# EAGLE design camera-endpoint (EAGLE 8.3.2)

## Sheet 1 of 2
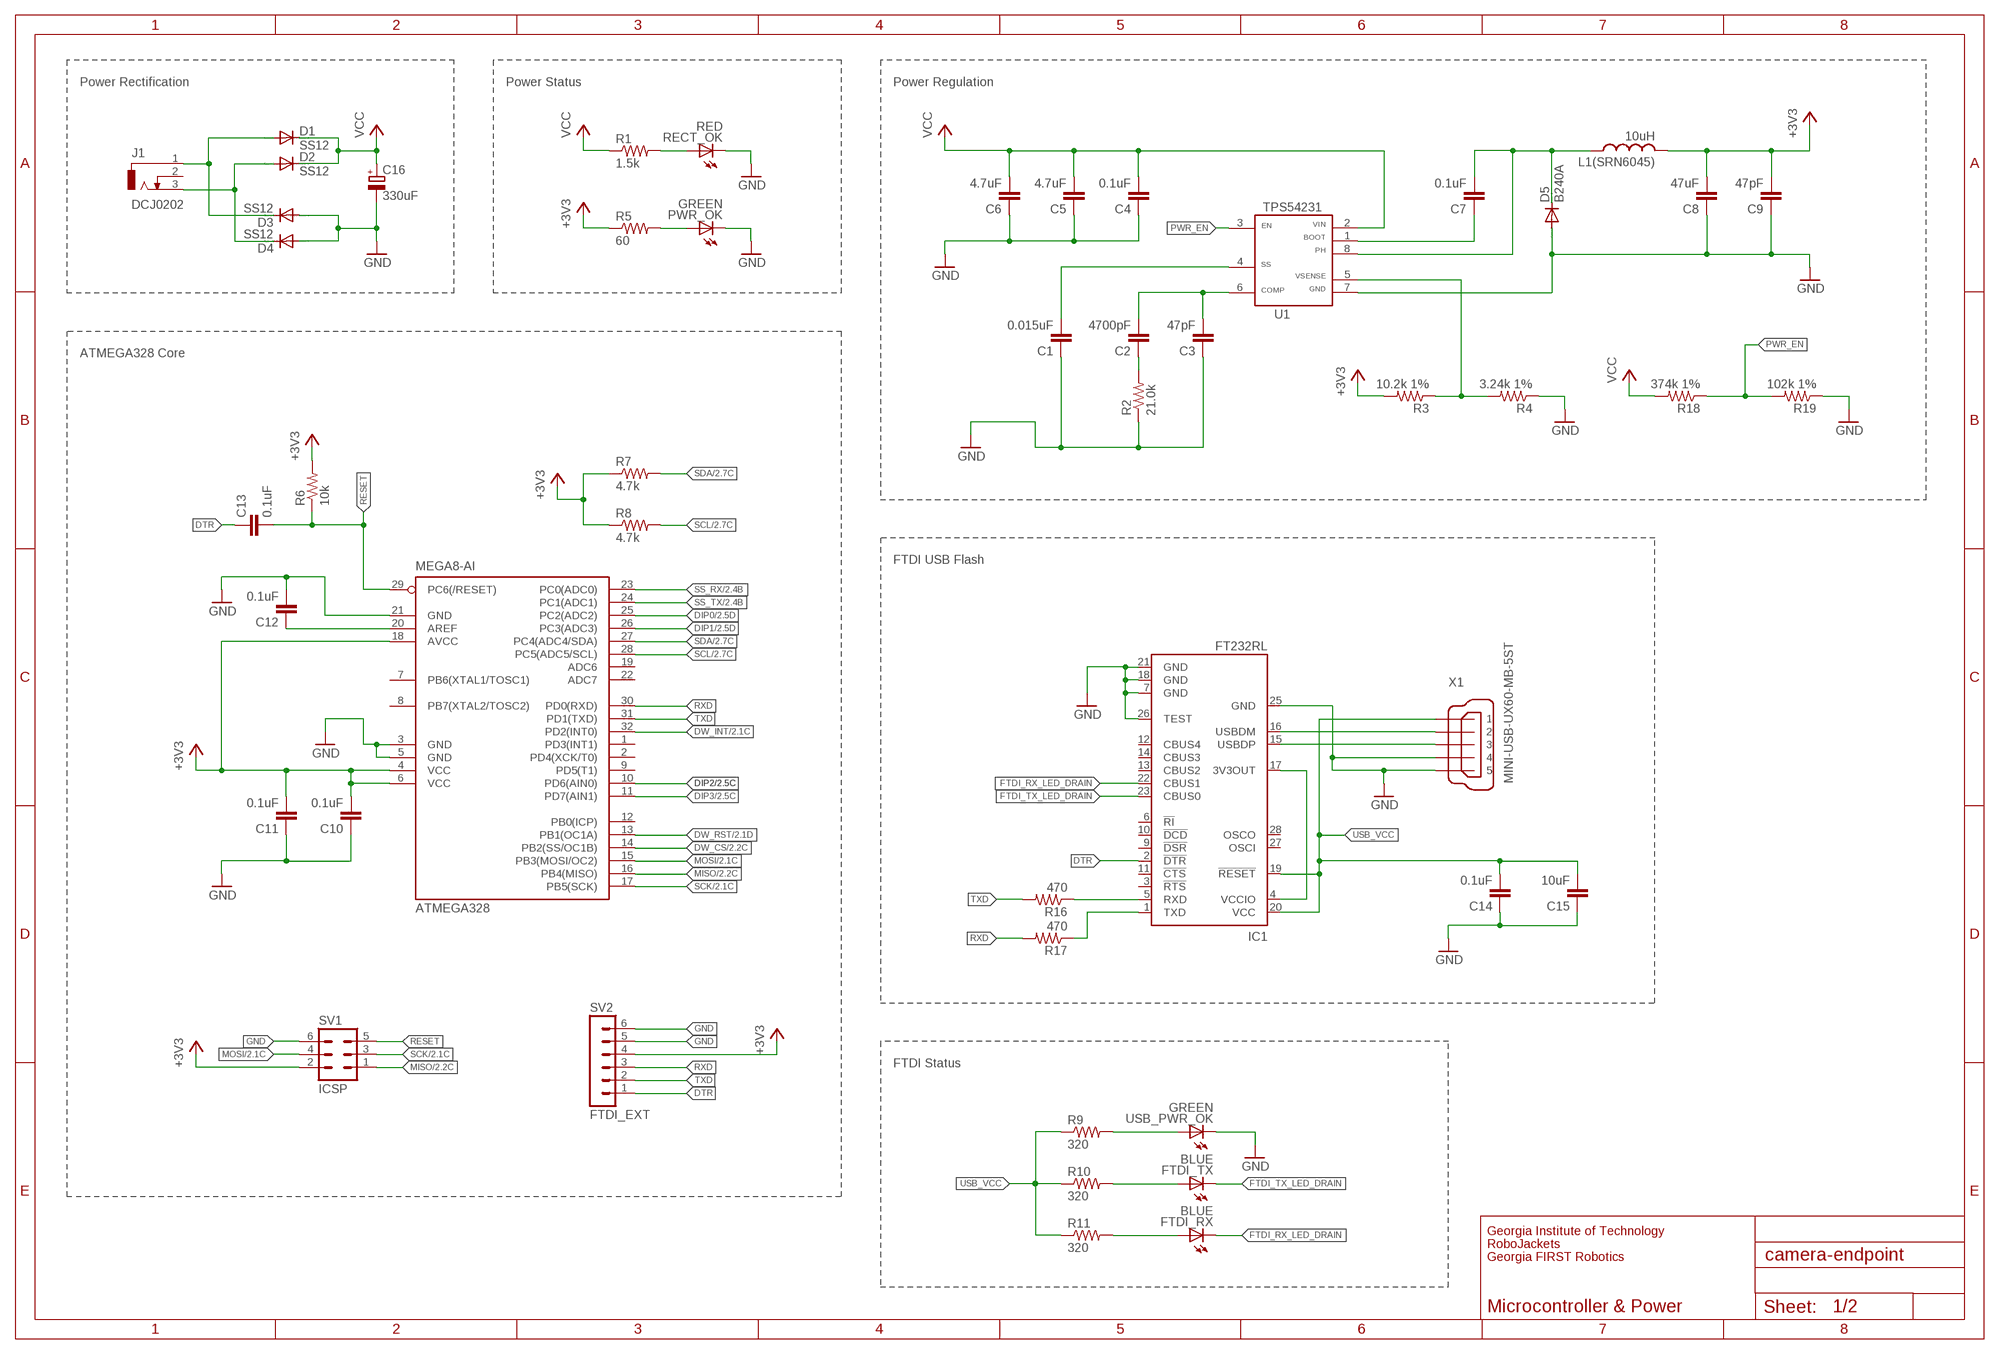
[diagram p0: schematic, sheet 1]

### Parts
ATMEGA328  MEGA8-AI  [TQFP32-08]
C1  0.015uF  C-EUC0603  [C0603]
C2  4700pF  C-EUC0603  [C0603]
C3  47pF  C-EUC0603  [C0603]
C4  0.1uF  C-EUC0603  [C0603]
C5  4.7uF  C-EUC0603  [C0603]
C6  4.7uF  C-EUC0603  [C0603]
C7  0.1uF  C-EUC0603  [C0603]
C8  47uF  C-EUC1206  [C1206]
C9  47pF  C-EUC0603  [C0603]
C10  0.1uF  C-EUC0603  [C0603]
C11  0.1uF  C-EUC0603  [C0603]
C12  0.1uF  C-EUC0603  [C0603]
C13  0.1uF  C-EUC0603  [C0603]
C14  0.1uF  C-EUC0603  [C0603]
C15  10uF  C-EUC0603  [C0603]
C16  330uF  CPOL-EUE5-8.5  [E5-8,5]
D1  SS12  DIODE-DO214AC  [DO214AC]
D2  SS12  DIODE-DO214AC  [DO214AC]
D3  SS12  DIODE-DO214AC  [DO214AC]
D4  SS12  DIODE-DO214AC  [DO214AC]
D5  B240A  DIODE-DO-214AC  [DO-214AC]
FTDI_RX  BLUE  LEDCHIP-LED0603  [CHIP-LED0603]
FTDI_TX  BLUE  LEDCHIP-LED0603  [CHIP-LED0603]
IC1  FT232RL  [SSOP28]
J1  DCJ0202  [DCJ0202]
L1(SRN6045)  10uH  L-USWE-TPC  [POWER-CHOKE_WE-TPC]
PWR_OK  GREEN  LED5MM  [LED5MM]
R1  1.5k  R-US_R0603  [R0603]
R2  21.0k  R-US_R0603  [R0603]
R3  10.2k 1%  R-US_R0603  [R0603]
R4  3.24k 1%  R-US_R0603  [R0603]
R5  60  R-US_R0603  [R0603]
R6  10k  R-US_R0603  [R0603]
R7  4.7k  R-US_R0603  [R0603]
R8  4.7k  R-US_R0603  [R0603]
R9  320  R-US_R0603  [R0603]
R10  320  R-US_R0603  [R0603]
R11  320  R-US_R0603  [R0603]
R16  470  R-US_R0603  [R0603]
R17  470  R-US_R0603  [R0603]
R18  374k 1%  R-US_R0603  [R0603]
R19  102k 1%  R-US_R0603  [R0603]
RECT_OK  RED  LED5MM  [LED5MM]
SV1  ICSP  MA03-2  [MA03-2]
SV2  FTDI_EXT  MA06-1  [MA06-1]
U1  TPS54231SO8  [SO8]
USB_PWR_OK  GREEN  LEDCHIP-LED0603  [CHIP-LED0603]
X1  MINI-USB-UX60-MB-5ST  [UX60-MB-5ST]

### Nets
+3V3: ATMEGA328.4(VCC) ATMEGA328.6(VCC) ATMEGA328.18(AVCC) C8.2 C9.2 C10.2 C11.2 L1(SRN6045).2 R3.2 R5.1 R6.2 R7.1 R8.1 SV1.2 SV2.4 ; also sheet 2
DIP0: ATMEGA328.25(PC2(ADC2)) ; also sheet 2
DIP1: ATMEGA328.26(PC3(ADC3)) ; also sheet 2
DIP2: ATMEGA328.10(PD6(AIN0)) ; also sheet 2
DIP3: ATMEGA328.11(PD7(AIN1)) ; also sheet 2
DTR: C13.1 IC1.2(!DTR) SV2.1
DW_CS: ATMEGA328.14(PB2(SS/OC1B)) ; also sheet 2
DW_INT: ATMEGA328.32(PD2(INT0)) ; also sheet 2
DW_RST: ATMEGA328.13(PB1(OC1A)) ; also sheet 2
FTDI_RX_LED_DRAIN: FTDI_RX.C IC1.22(CBUS1)
FTDI_TX_LED_DRAIN: FTDI_TX.C IC1.23(CBUS0)
GND: ATMEGA328.3(GND) ATMEGA328.5(GND) ATMEGA328.21(GND) C1.1 C3.1 C4.1 C5.1 C6.1 C8.1 C9.1 C10.1 C11.1 C12.2 C14.1 C15.1 C16.- D3.A D4.A D5.A IC1.7(GND) IC1.18(GND) IC1.21(GND) IC1.25(GND) IC1.26(TEST) PWR_OK.K(C) R2.1 R4.1 R19.1 RECT_OK.K(C) SV1.6 SV2.5 SV2.6 U1.7 USB_PWR_OK.C X1.4 X1.5 ; also sheet 2
MISO: ATMEGA328.16(PB4(MISO)) SV1.1 ; also sheet 2
MOSI: ATMEGA328.15(PB3(MOSI/OC2)) SV1.4 ; also sheet 2
N$1: D1.A D3.C J1.1
N$2: D2.A D4.C J1.3
N$3: R1.2 RECT_OK.A
N$4: C2.1 R2.2
N$5: C7.1 U1.1
N$6: C7.2 D5.C L1(SRN6045).1 U1.8
N$7: R3.1 R4.2 U1.5
N$8: PWR_OK.A R5.2
N$9: ATMEGA328.20(AREF) C12.1
N$10: IC1.5(RXD) R16.1
N$11: IC1.4(VCCIO) IC1.17(3V3OUT)
N$12: R9.2 USB_PWR_OK.A
N$13: IC1.1(TXD) R17.1
N$15: IC1.16(USBDM) X1.2
N$16: IC1.15(USBDP) X1.3
N$17: FTDI_TX.A R10.2
N$20: FTDI_RX.A R11.2
PWR_EN: R18.1 R19.2 U1.3
PWRREG_COMP: C2.2 C3.2 U1.6
PWRREG_SS: C1.2 U1.4
RESET: ATMEGA328.29(PC6(/RESET)) C13.2 R6.1 SV1.5
RXD: ATMEGA328.30(PD0(RXD)) R17.2 SV2.3
SCK: ATMEGA328.17(PB5(SCK)) SV1.3 ; also sheet 2
SCL: ATMEGA328.28(PC5(ADC5/SCL)) R8.2 ; also sheet 2
SDA: ATMEGA328.27(PC4(ADC4/SDA)) R7.2 ; also sheet 2
SS_RX: ATMEGA328.23(PC0(ADC0)) ; also sheet 2
SS_TX: ATMEGA328.24(PC1(ADC1)) ; also sheet 2
TXD: ATMEGA328.31(PD1(TXD)) R16.2 SV2.2
USB_VCC: C14.2 C15.2 IC1.19(!RESET) IC1.20(VCC) R9.1 R10.1 R11.1 X1.1
VCC: C4.2 C5.2 C6.2 C16.+ D1.C D2.C R1.1 R18.2 U1.2 ; also sheet 2
Unconnected: ATMEGA328.1(PD3(INT1)) ATMEGA328.2(PD4(XCK/T0)) ATMEGA328.7(PB6(XTAL1/TOSC1)) ATMEGA328.8(PB7(XTAL2/TOSC2)) ATMEGA328.9(PD5(T1)) ATMEGA328.12(PB0(ICP)) ATMEGA328.19(ADC6) ATMEGA328.22(ADC7) IC1.3(!RTS) IC1.6(!RI) IC1.9(!DSR) IC1.10(!DCD) IC1.11(!CTS) IC1.12(CBUS4) IC1.13(CBUS2) IC1.14(CBUS3) IC1.27(OSCI) IC1.28(OSCO) J1.2

### Notes on the sheet
- Power Rectification | Power Status | Power Regulation
- ATMEGA328 Core
- FTDI USB Flash
- FTDI Status
- Georgia Institute of Technology
- RoboJackets
- Georgia FIRST Robotics
- Microcontroller & Power

## Sheet 2 of 2
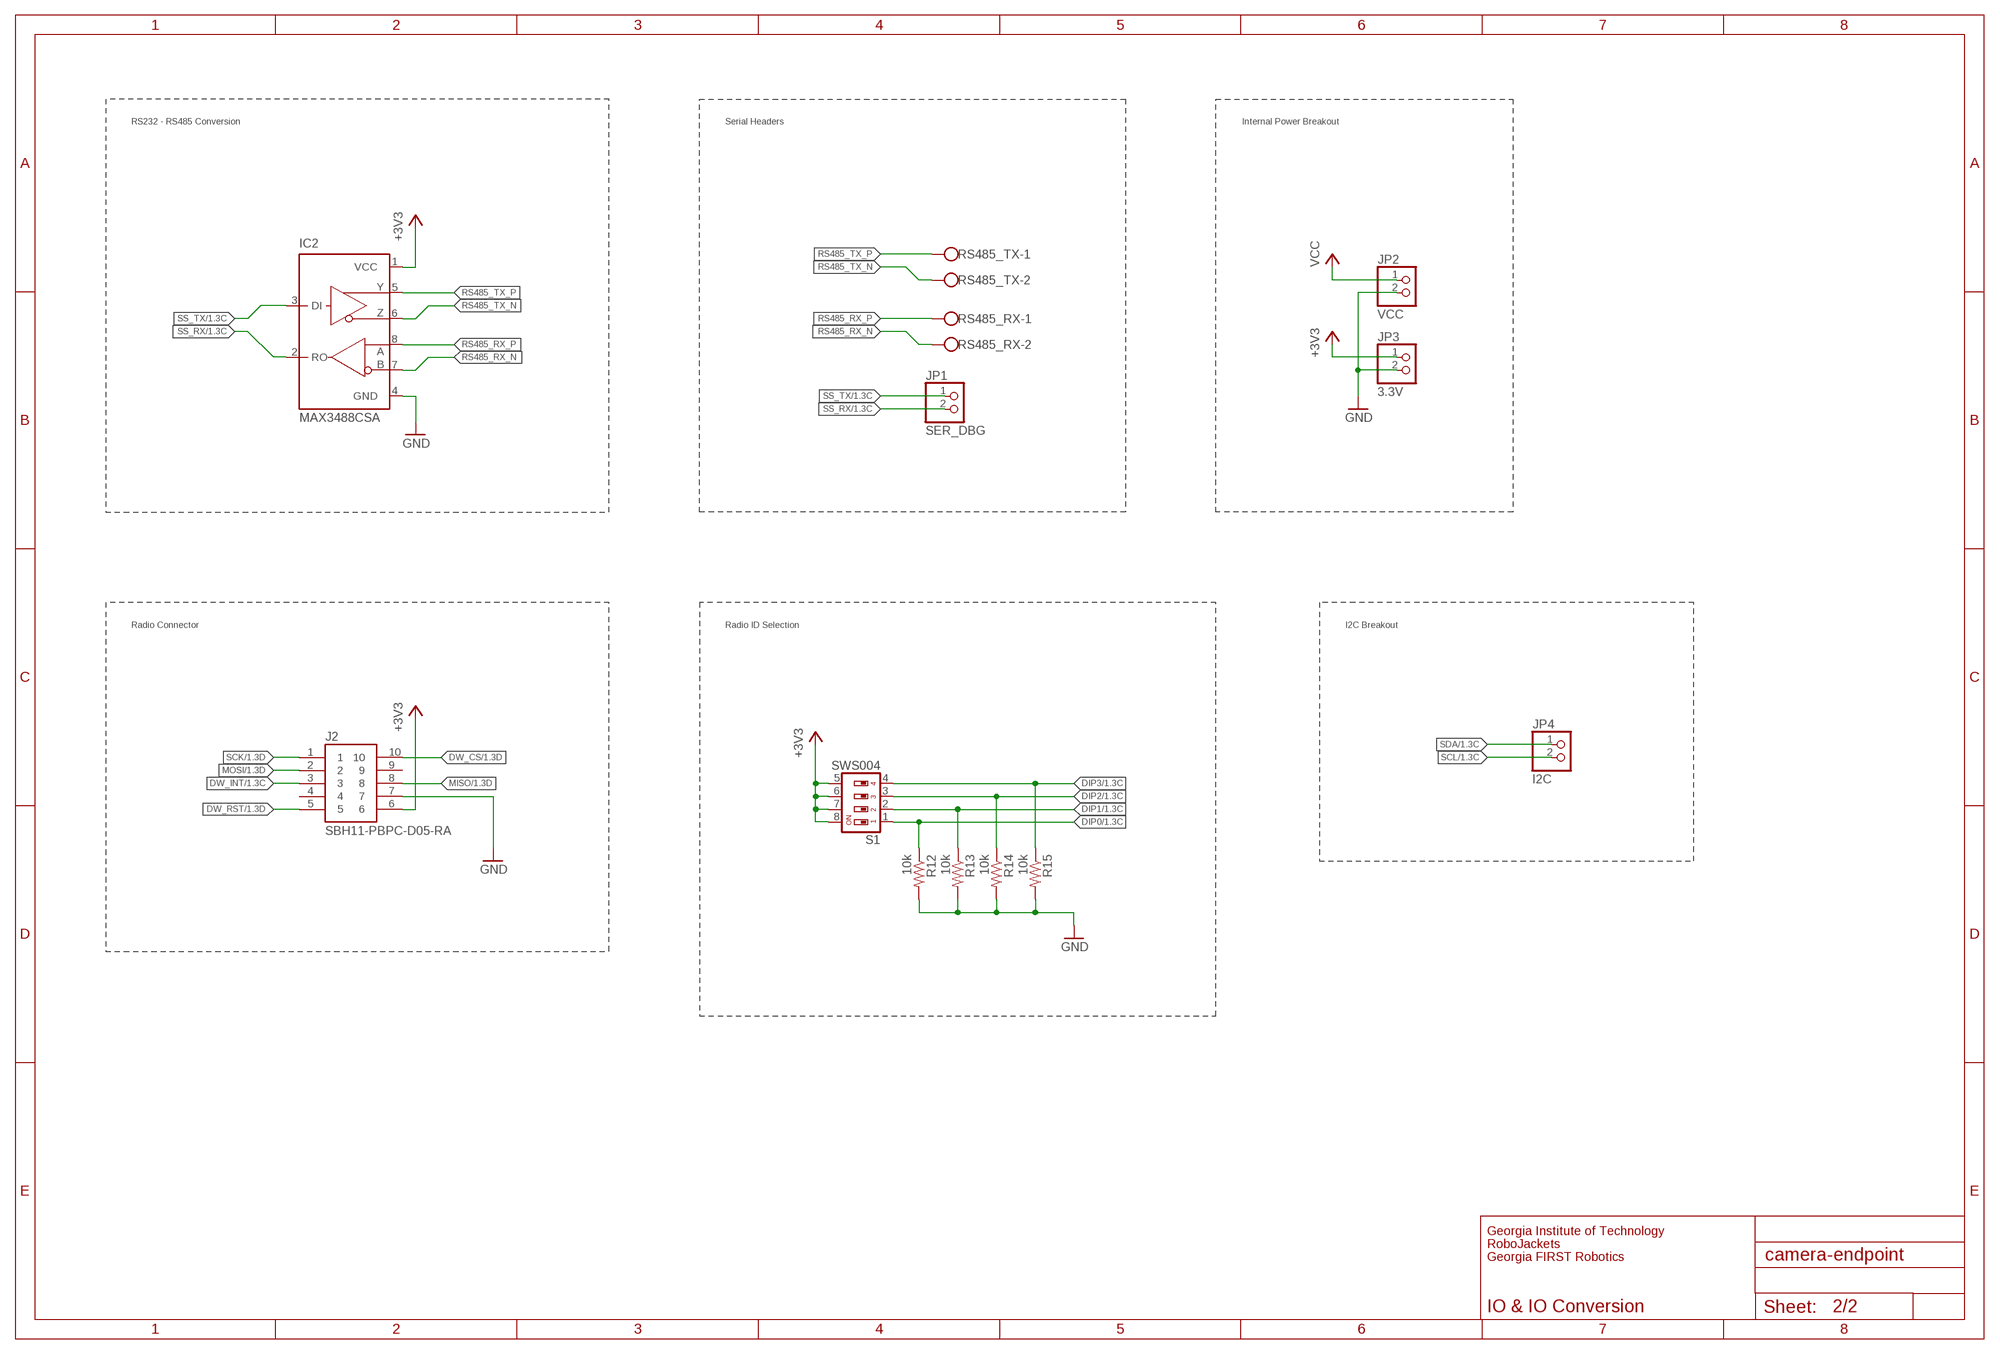
[diagram p1: schematic, sheet 2]

### Parts
IC2  MAX3488CSA  MAX3467CPA  [SO08]
J2  SBH11-PBPC-D05-RA  [SBH11-*-D05-RA]
JP1  SER_DBG  PINHD-1X2  [1X02]
JP2  VCC  PINHD-1X2  [1X02]
JP3  3.3V  PINHD-1X2  [1X02]
JP4  I2C  PINHD-1X2  [1X02]
R12  10k  R-US_R0603  [R0603]
R13  10k  R-US_R0603  [R0603]
R14  10k  R-US_R0603  [R0603]
R15  10k  R-US_R0603  [R0603]
RS485_RX  W237-102  [W237-102]
RS485_TX  W237-102  [W237-102]
S1  SWS004  [SMS-004]

### Nets
+3V3: IC2.1(VCC) J2.6 JP3.1 S1.5 S1.6 S1.7 S1.8 ; also sheet 1
DIP0: R12.1 S1.1 ; also sheet 1
DIP1: R13.1 S1.2 ; also sheet 1
DIP2: R14.1 S1.3 ; also sheet 1
DIP3: R15.1 S1.4 ; also sheet 1
DW_CS: J2.10 ; also sheet 1
DW_INT: J2.3 ; also sheet 1
DW_RST: J2.5 ; also sheet 1
GND: IC2.4(GND) J2.7 JP2.2 JP3.2 R12.2 R13.2 R14.2 R15.2 ; also sheet 1
MISO: J2.8 ; also sheet 1
MOSI: J2.2 ; also sheet 1
RS485_RX_N: IC2.7(B) RS485_RX.2
RS485_RX_P: IC2.8(A) RS485_RX.1
RS485_TX_N: IC2.6(Z) RS485_TX.2
RS485_TX_P: IC2.5(Y) RS485_TX.1
SCK: J2.1 ; also sheet 1
SCL: JP4.2 ; also sheet 1
SDA: JP4.1 ; also sheet 1
SS_RX: IC2.2(RO) JP1.2 ; also sheet 1
SS_TX: IC2.3(DI) JP1.1 ; also sheet 1
VCC: JP2.1 ; also sheet 1
Unconnected: J2.4 J2.9

### Notes on the sheet
- RS232 - RS485 Conversion | Serial Headers | Internal Power Breakout
- Radio Connector | Radio ID Selection | I2C Breakout
- Georgia Institute of Technology
- RoboJackets
- Georgia FIRST Robotics
- IO & IO Conversion

## Library data of the parts
ATMEGA328 = atmel:MEGA8: MICROCONTROLLER 8 Kbytes FLASH, 1 kbytes SRAM, 512 bytes EEPROM, USART, 6-channel 10 bit ADC, 2-channel 8 bit ADC Pin compatible with Atmega48, ATMega88, ATMega168 Source: avr.lbr; MPN: ATMEGA8-16AU; OC_FARNELL: 9171371; OC_NEWARK: 73M8863
C1-C7 C9-C15 = resistor:C-EU: CAPACITOR, European symbol
C8 = rcl:C-EU: CAPACITOR, European symbol
C16 = rcl:CPOL-EU: POLARIZED CAPACITOR, European symbol
D1-D5 = diode:DIODE-: DIODE
FTDI_RX FTDI_TX PWR_OK RECT_OK USB_PWR_OK = led:LED: LED OSRAM: - CHIPLED LG R971, LG N971, LY N971, LG Q971, LY Q971, LO R971, LY R971 LH N974, LH R974 LS Q976, LO Q976, LY Q976 LO Q996 - Hyper CHIPLED LW Q18S LB Q993, LB Q99A, LB R99A - SideLED LS A670, LO A670, LY A670, LG A670, LP A670 LB A673, LV A673, LT A673, LW A673 LH A674 LY A675 LS A676, LA A676, LO A676, LY A676, LW A676 LS A679, LY A679, LG A679 - Hyper Micro SIDELED® LS Y876, LA Y876, LO Y876, LY Y876 LT Y87S - SmartLED LW L88C, LW L88S LB L89C, LB L89S, LG L890 LS L89K, LO L89K, LY L89K LS L896, LA L896, LO L896, LY L896 - TOPLED LS T670, LO T670, LY T670, LG T670, LP T670 LSG T670, LSP T670, LSY T670, LOP T670, LYG T670 LG T671, LOG T671, LSG T671 LB T673, LV T673, LT T673, LW T673 LH T674 LS T676, LA T676, LO T676, LY T676, LB T676, LH T676, LSB T676, LW T676 LB T67C, LV T67C, LT T67C, LS T67K, LO T67K, LY T67K, LW E67C LS E67B, LA E67B, LO E67B, LY E67B, LB E67C, LV E67C, LT E67C LW T67C LS T679, LY T679, LG T679 LS T770, LO T770, LY T770, LG T770, LP T770 LB T773, LV T773, LT T773, LW T773 LH T774 LS E675, LA E675, LY E675, LS T675 LS T776, LA T776, LO T776, LY T776, LB T776 LHGB T686 LT T68C, LB T68C - Hyper Mini TOPLED® LB M676 - Mini TOPLED Santana® LG M470 LS M47K, LO M47K, LY M47K Source: http://www.osram.convergy.de LUXEON: - LUMILED® LXK2-PW12-R00, LXK2-PW12-S00, LXK2-PW14-U00, LXK2-PW14-V00 LXK2-PM12-R00, LXK2-PM12-S00, LXK2-PM14-U00 LXK2-PE12-Q00, LXK2-PE12-R00, LXK2-PE12-S00, LXK2-PE14-T00, LXK2-PE14-U00 LXK2-PB12-K00, LXK2-PB12-L00, LXK2-PB12-M00, LXK2-PB14-N00, LXK2-PB14-P00, LXK2-PB14-Q00 LXK2-PR12-L00, LXK2-PR12-M00, LXK2-PR14-Q00, LXK2-PR14-R00 LXK2-PD12-Q00, LXK2-PD12-R00, LXK2-PD12-S00 LXK2-PH12-R00, LXK2-PH12-S00 LXK2-PL12-P00, LXK2-PL12-Q00, LXK2-PL12-R00 Source: www.luxeon.com KINGBRIGHT: KA-3528ASYC Source: www.kingbright.com
IC1 = ftdichip:FT232R: Source: http://www.ftdichip.com/Documents/DataSheets/DS_FT232R_v104.pdf; MPN: FT232RL; OC_FARNELL: 1146032; OC_NEWARK: 91K9918
IC2 = maxim:MAX3467*: +5V, Fail-Safe, 40Mbps, Profibus RS-485/RS-422 Transceivers Source: MAX3465-MAX3469.pdf; OC_FARNELL: unknown; OC_NEWARK: unknown
J1 = con-jack:DCJ0202: DC POWER JACK Source: DCJ0202.pdf; OC_FARNELL: unknown; OC_NEWARK: unknown
J2 = RoboJackets-Connectors:SBH11-*-D05-?; DIGIKEY: S9177-ND; MPN: SBH11-PBPC-D05-RA-BK
JP1-JP4 = pinhead:PINHD-1X2: PIN HEADER
L1(SRN6045) = rcl:L-US: INDUCTOR, American symbol
R1-R19 = resistor:R-US_: RESISTOR, American symbol
RS485_RX RS485_TX = con-wago-500:W237-102: WAGO SCREW CLAMP; MPN: 237-102; OC_FARNELL: unknown; OC_NEWARK: 70K9898
S1 = smd-special:SWS004: SMD Dip Switch 4 pol.
SV1 = con-lstb:MA03-2: PIN HEADER; OC_FARNELL: unknown; OC_NEWARK: unknown
SV2 = con-lstb:MA06-1: PIN HEADER; OC_FARNELL: unknown; OC_NEWARK: unknown
U1 = bqevm_additional_ti_ics:TPS54231: According to: http://www.ti.com/lit/ds/symlink/tps54231.pdf
X1 = con-hirose:MINI-USB-: MINI USB Connector Source: http://www.hirose.co.jp/cataloge_hp/e24000019.pdf; OC_FARNELL: unknown; OC_NEWARK: unknown

## Board
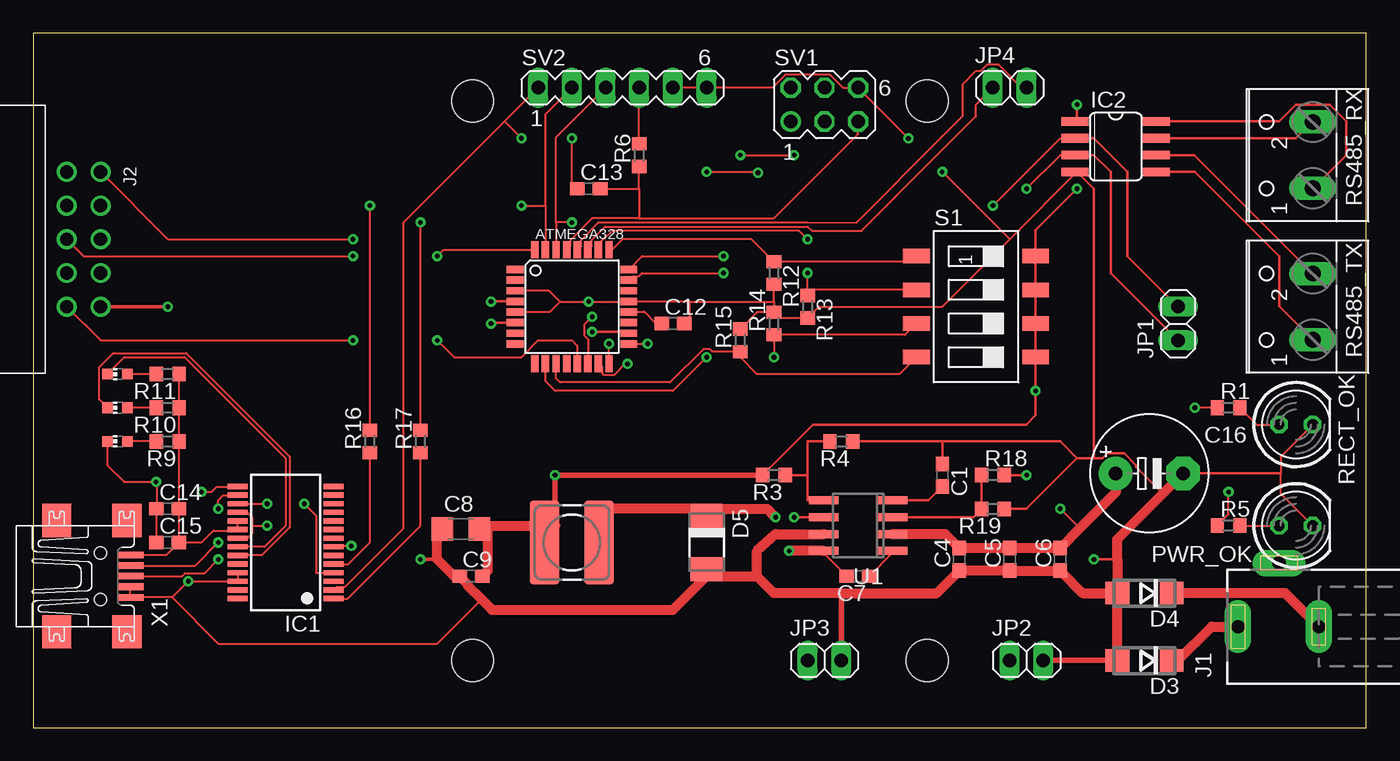
[diagram p2: board, top side]
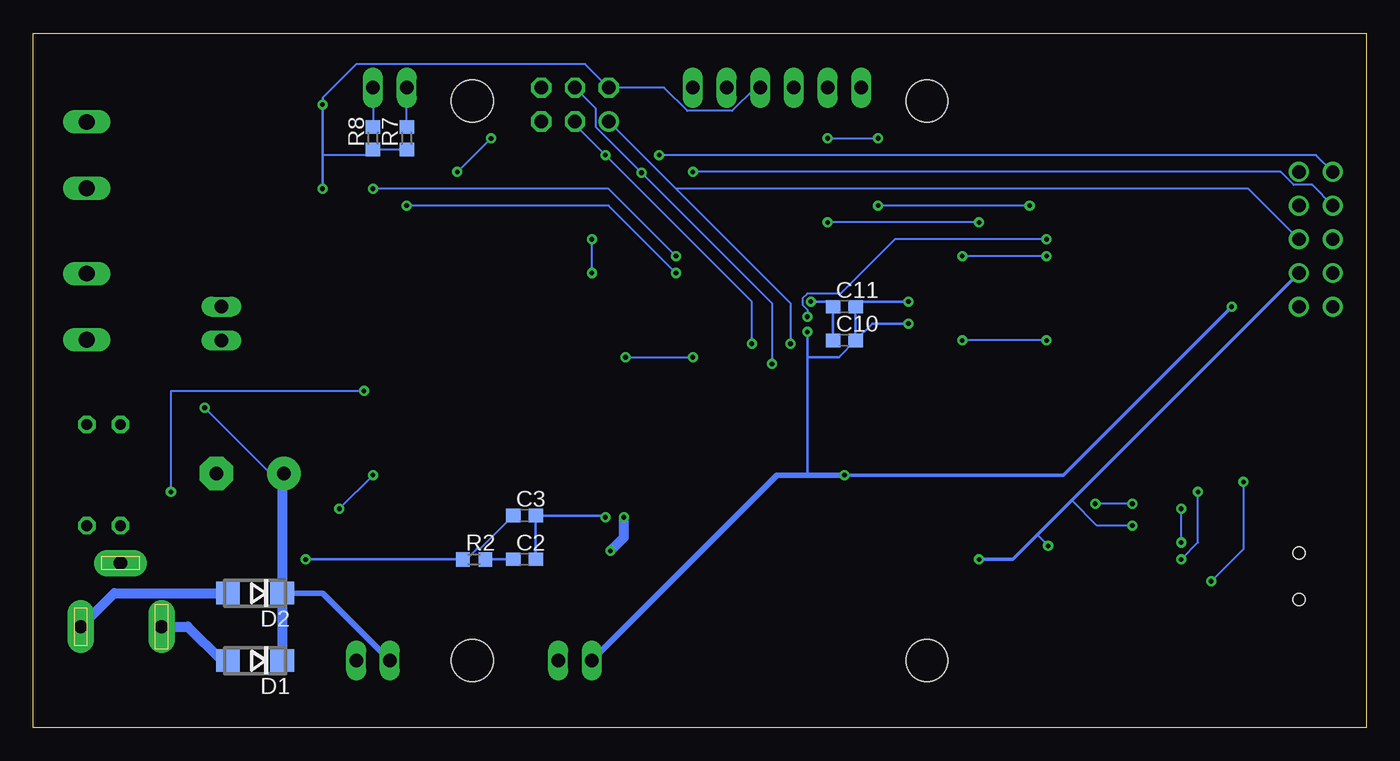
[diagram p3: board, bottom side, seen from below]

Size 100.56 x 52.38 mm. Coordinates in mm from the lower left corner, seen from the top.
Outline: 0,0 100.56,0 100.56,52.38 0,52.38 0,0
Copper layers (1*16): Top 0.035mm / dielectric 1.5mm / Bottom 0.035mm
Design rules "default": minimum track width 6mil, minimum drill 0.35mm, track to track 6mil, track to pad 6mil, pad to pad 6mil, via to via 6mil, smd to smd 6mil, copper to edge 40mil, drill to drill 6mil, minimum pad ring 10mil, minimum via ring 8mil, stop-mask expansion 4mil, vias tented up to drill 0mil, thermal gap 10mil
Holes 3.17 mm at 33.15,5.08 67.44,5.08 67.44,47.24 33.15,47.24

### Footprints (pad centres in the part's own frame; a part is rotated, then mirrored left to right if it is on the bottom)
TQFP32-08 = smd 1.27 x 0.559: 1 -4.293,2.8; 2 -4.293,2; 3 -4.293,1.2; 4 -4.293,0.4; 5 -4.293,-0.4; 6 -4.293,-1.2; 7 -4.293,-2; 8 -4.293,-2.8; 17 4.293,-2.8; 18 4.293,-2; 19 4.293,-1.2; 20 4.293,-0.4; 21 4.293,0.4; 22 4.293,1.2; 23 4.293,2; 24 4.293,2.8 | smd 0.559 x 1.27: 9 -2.8,-4.293; 10 -2,-4.293; 11 -1.2,-4.293; 12 -0.4,-4.293; 13 0.4,-4.293; 14 1.2,-4.293; 15 2,-4.293; 16 2.8,-4.293; 25 2.8,4.293; 26 2,4.293; 27 1.2,4.293; 28 0.4,4.293; 29 -0.4,4.293; 30 -1.2,4.293; 31 -2,4.293; 32 -2.8,4.293
C0603 = smd 1.1 x 1: 1 -0.85,0; 2 0.85,0
C1206 = smd 1.6 x 1.8: 1 -1.4,0; 2 1.4,0
E5-8,5 = drill 1.016 pad 2.54: + -2.54,0 | drill 1.016 pad 2.54 octagon: - 2.54,0
DO214AC = smd 1.8 x 1.7: A 2.05,0; C -2.05,0
DO-214AC = smd 1.8 x 2.4: A 2.025,0; C -2.025,0
CHIP-LED0603 = smd 0.8 x 0.8: A 0,-0.75; C 0,0.75
SSOP28 = smd 0.4 x 1.5: 1 -4.225,-3.625; 2 -3.575,-3.625; 3 -2.925,-3.625; 4 -2.275,-3.625; 5 -1.625,-3.625; 6 -0.975,-3.625; 7 -0.325,-3.625; 8 0.325,-3.625; 9 0.975,-3.625; 10 1.625,-3.625; 11 2.275,-3.625; 12 2.925,-3.625; 13 3.575,-3.625; 14 4.225,-3.625; 15 4.225,3.625; 16 3.575,3.625; 17 2.925,3.625; 18 2.275,3.625; 19 1.625,3.625; 20 0.975,3.625; 21 0.325,3.625; 22 -0.325,3.625; 23 -0.975,3.625; 24 -1.625,3.625; 25 -2.275,3.625; 26 -2.925,3.625; 27 -3.575,3.625; 28 -4.225,3.625
SO08 = smd 0.66 x 2.032: 1 -1.905,-3.073; 2 -0.635,-3.073; 3 0.635,-3.073; 4 1.905,-3.073; 5 1.905,3.073; 6 0.635,3.073; 7 -0.635,3.073; 8 -1.905,3.073
DCJ0202 = drill 1 pad 2 long: 1 0,3.1; 2 4.8,0; 3 0,-3
SBH11-*-D05-RA = drill 1: 1 -5.08,-1.27; 2 -2.54,-1.27; 3 0,-1.27; 4 2.54,-1.27; 5 5.08,-1.27; 6 5.08,1.27; 7 2.54,1.27; 8 0,1.27; 9 -2.54,1.27; 10 -5.08,1.27
1X02 = drill 1.016 long: 1 -1.27,0; 2 1.27,0
POWER-CHOKE_WE-TPC = smd 6.3 x 2.2: 1 0,2.05; 2 0,-2.05
LED5MM = drill 0.813 octagon: A -1.27,0; K 1.27,0
R0603 = smd 1 x 1.1: 1 -0.85,0; 2 0.85,0
W237-102 = drill 1.194 long: 1 -2.5,-1.27; 2 2.5,-1.27
SMS-004 = smd 1.092 x 2.007: 1 -3.81,-4.496; 2 -1.27,-4.496; 3 1.27,-4.496; 4 3.81,-4.496; 5 3.81,4.496; 6 1.27,4.496; 7 -1.27,4.496; 8 -3.81,4.496
MA03-2 = drill 1.016: 1 -2.54,-1.27 | drill 1.016 octagon: 2 -2.54,1.27; 3 0,-1.27; 4 0,1.27; 5 2.54,-1.27; 6 2.54,1.27
MA06-1 = drill 1.016 long: 1 -6.35,0; 2 -3.81,0; 3 -1.27,0; 4 1.27,0; 5 3.81,0; 6 6.35,0
SO8 = smd 0.6 x 2.2: 1 -1.905,-2.6; 2 -0.635,-2.6; 3 0.635,-2.6; 4 1.905,-2.6; 5 1.905,2.6; 6 0.635,2.6; 7 -0.635,2.6; 8 -1.905,2.6
UX60-MB-5ST = smd 2 x 0.5: 1 2.25,1.6; 2 2.25,0.8; 3 2.25,0; 4 2.25,-0.8; 5 2.25,-1.6 | smd 2.2 x 2.5: M1 -3.3,-4.2; M2 -3.3,4.2; M3 2,4.2; M4 2,-4.2 | hole 0.9: 0,-1.75; 0,1.75

### Placement (x,y rotation side)
ATMEGA328  40.64,31.75 0 top
C1  68.58,19.05 270 top
C2  63.5,12.7 0 bottom
C3  63.5,16 0 bottom
C4  69.85,12.7 90 top
C5  73.66,12.7 90 top
C6  77.47,12.7 90 top
C7  62.23,11.43 180 top
C8  32.26,14.99 0 top
C9  33.02,11.43 0 top
C10  39.37,29.21 0 bottom
C11  39.37,31.75 0 bottom
C12  48.26,30.48 0 top
C13  41.91,40.64 0 top
C14  10.16,16.51 0 top
C15  10.16,13.97 0 top
C16  84.2,19.18 0 top
D1  83.82,5.08 180 bottom
D2  83.82,10.16 180 bottom
D3  83.82,5.08 180 top
D4  83.82,10.16 180 top
D5  50.8,13.97 270 top
FTDI_RX  6.35,26.67 90 top
FTDI_TX  6.35,24.13 90 top
IC1  19.05,13.97 90 top
IC2  81.66,43.81 270 top
J1  93.98,7.62 90 top
J2  3.81,36.83 270 top
JP1  86.36,30.48 90 top
JP2  74.93,5.08 0 top
JP3  59.69,5.08 0 top
JP4  73.66,48.26 0 top
L1(SRN6045)  40.64,13.97 270 top
PWR_OK  95.25,15.24 0 top
R1  90.17,24.13 0 top
R2  67.31,12.7 0 bottom
R3  55.88,19.05 180 top
R4  60.96,21.59 180 top
R5  90.17,15.24 0 top
R6  45.72,43.18 90 top
R7  72.39,44.45 90 bottom
R8  74.93,44.45 90 bottom
R9  10.16,21.59 180 top
R10  10.16,24.13 180 top
R11  10.16,26.67 180 top
R12  55.88,34.29 270 top
R13  58.42,31.75 270 top
R14  55.88,30.48 90 top
R15  53.34,29.21 90 top
R16  25.4,21.59 90 top
R17  29.21,21.59 90 top
R18  72.39,19.05 0 top
R19  72.39,16.51 180 top
RECT_OK  95.25,22.86 0 top
RS485_RX  95.25,43.18 90 top
RS485_TX  95.25,31.75 90 top
S1  71.12,31.75 270 top
SV1  59.69,46.99 0 top
SV2  44.45,48.26 0 top
U1  62.23,15.24 90 top
USB_PWR_OK  6.35,21.59 90 top
X1  5.08,11.43 0 top

### Tracks (layer width: path | path; a pad name or v marks a point on that pad's centre or on a via)
+3V3  (via drill 0.35)
  Top 0.152: R6.2 SV2.4 | R5.1 90.17,16.09 v90.17,17.78
  Top 0.203: S1.6 S1.8 75.62,37.52 v78.74,40.64 | S1.6 S1.5 v75.62,25.4 75.62,23.55 74.93,22.86 58.84,22.86 R3.2 | S1.7 S1.6 | v78.74,46.99 78.74,45.87 IC2.1 | ATMEGA328.18 44.84,29.84 v42.16,29.84 | v34.54,32.13 34.56,32.15 ATMEGA328.4 | v34.54,30.48 34.61,30.55 ATMEGA328.6
  Top 0.254: J2.6 v10.16,31.75
  Top 0.406: 39.37,15.24 v39.37,19.05 R3.2
  Top 0.762: C9.2 34.29,11.85 34.29,15.24 | 34.29,15.24 39.37,15.24 38.59,14.46 L1(SRN6045).2 | C8.2 33.91,15.24 34.29,15.24
  Bottom 0.152: R7.1 R8.1 75.35,43.18 78.74,43.18 | SV2.4 46.1,48.26 47.85,46.51 51.21,46.51 52.96,48.26 SV1.2 58.93,50.04 76.2,50.04 78.74,47.5 v78.74,46.99 | v90.17,17.78 90.17,25.4 v75.62,25.4
  Bottom 0.203: v78.74,40.64 78.74,43.18 v78.74,46.99 | 42.16,27.94 v42.16,29.84 | 42.16,27.94 42.16,19.05 | v34.54,32.13 38.14,32.13 C11.2 C10.2 | C10.2 37.25,30.48 v34.54,30.48 | C10.2 39.79,27.94 42.16,27.94
  Bottom 0.254: v10.16,31.75 22.86,19.05 v39.37,19.05
  Bottom 0.406: JP3.1 44.45,19.05 42.16,19.05 v39.37,19.05
DIP0
  Top 0.152: S1.1 66.2,35.14 R12.1 54.19,36.83 44.45,36.83 43.66,36.04 ATMEGA328.25
DIP1  (via drill 0.35)
  Top 0.152: S1.2 58.42,33.02 R13.1 v58.42,34.29 | v58.42,36.83 57.76,37.49 43.69,37.49 43.1,36.91 43.07,36.91 42.64,36.48 ATMEGA328.26
  Bottom 0.152: v58.42,34.29 v58.42,36.83
DIP2  (via drill 0.35)
  Top 0.152: S1.3 65.77,29.63 R14.1 v55.88,27.94 | v50.8,27.94 48.26,25.4 39.37,25.4 38.64,26.13 ATMEGA328.10
  Bottom 0.152: v55.88,27.94 v50.8,27.94
DIP3
  Top 0.152: S1.4 65.35,26.67 54.61,26.67 53.34,27.94 R15.1 51.24,28.36 51.05,28.55 50.55,28.55 48.04,26.04 39.75,26.04 39.44,26.35 ATMEGA328.11
DTR  (via drill 0.35)
  Top 0.152: IC1.2 22.9,10.62 23.52,10.62 27.94,15.04 27.94,38.1 35.56,45.72 | 35.56,45.72 SV2.1 | C13.1 40.64,41.06 v40.64,44.45 | v36.83,44.45 35.56,45.72
  Bottom 0.152: v40.64,44.45 v36.83,44.45
DW_CS  (via drill 0.35)
  Top 0.152: J2.10 10.16,36.83 v24.13,36.83 | ATMEGA328.14 41.84,29.31 41.56,29.59 41.56,30.38 v42.16,30.99
  Bottom 0.152: v24.13,36.83 35.56,36.83 39.65,32.74 42.16,32.74 42.52,32.38 42.52,31.88 42.16,31.53 v42.16,30.99
DW_INT  (via drill 0.35)
  Top 0.152: J2.3 3.81,35.56 v24.13,35.56 | v30.48,35.56 30.96,36.04 ATMEGA328.32
  Bottom 0.152: v24.13,35.56 v30.48,35.56
DW_RST  (via drill 0.35)
  Top 0.152: J2.5 5.08,29.21 v24.13,29.21 | v30.48,29.21 31.75,27.94 36.83,27.94 38.1,29.21 40.64,29.21 41.04,28.81 ATMEGA328.13
  Bottom 0.152: v24.13,29.21 v30.48,29.21
FTDI_RX_LED_DRAIN
  Top 0.152: FTDI_RX.C 6.87,27.94 11.43,27.94 19.05,20.32 19.05,15.24 17.45,13.64 IC1.22
FTDI_TX_LED_DRAIN
  Top 0.152: FTDI_TX.C 4.97,24.76 4.97,27.16 6.05,28.25 11.56,28.25 19.36,20.45 19.36,15.11 17.24,12.99 IC1.23
GND  (via drill 0.35)
  Top 0.152: 10.49,9.83 X1.5 X1.4 | 33.81,9.68 30.48,6.35 13.97,6.35 10.49,9.83 | 10.49,9.83 v11.71,11.04 IC1.26 15.43,11.68 | 15.43,11.68 IC1.25 | IC1.21 16.18,14.29 16.51,14.62 16.51,15.24 | 16.13,11.68 15.43,11.68 | IC1.18 16.14,16.25 16.51,15.88 16.51,15.24 | C15.1 C14.1 9.31,18.5 v9.27,18.54 6.86,18.54 5.6,19.8 USB_PWR_OK.C | R15.2 54.61,31.33 R14.2 | R14.2 56.31,30.9 R13.2 59.27,31.75 68.58,31.75 73.66,36.83 | 55.88,32.13 R12.2 | 55.88,32.13 R14.2 | 73.66,36.83 78.74,41.91 | 49.53,32.13 44.95,32.13 ATMEGA328.21 44.91,32.13 v41.91,32.13 39.75,32.13 | 49.53,32.13 55.88,32.13 | 39.75,32.13 38.93,32.95 ATMEGA328.3 | ATMEGA328.5 36.37,31.37 38.99,31.37 39.75,32.13 | SV2.5 SV2.6 55.75,48.26 56.74,49.25 60.1,49.25 61.09,48.26 SV1.6 v66.04,44.45 v66.03,44.44 | v68.58,41.91 73.66,36.83 | C12.2 49.53,30.9 49.53,32.13 | 16.51,15.24 v17.65,15.24 | IC1.7 22.75,13.72 v24,13.72 | RECT_OK.K 94.11,20.45 94.11,19.18 94.11,17.65 PWR_OK.K
  Top 0.203: R19.1 74.93,16.51 78.74,20.32 | 80.01,20.32 78.74,20.32 | 80.01,20.32 80.65,20.32 81.03,20.7 82.29,20.7 83.19,19.81 83.19,19.68 85.22,17.65 | v80.01,12.7 81.77,12.7 | 94.11,19.18 C16.- | 68.58,21.59 R4.1 | 68.58,21.59 77.47,21.59 78.74,20.32 | C1.1 68.58,21.59 | IC2.4 78.74,41.91 80.01,40.64 80.01,20.32
  Top 0.254: v29.21,12.7 30.48,12.7
  Top 0.406: JP3.2 60.96,10.16 | JP2.2 D3.A
  Top 0.762: D3.A D4.A | C16.- 85.22,17.65 81.77,14.21 81.77,12.7 D4.A | D4.A 79.16,10.16 C6.1 C5.1 C4.1 68.16,10.16 60.96,10.16 55.88,10.16 54.61,11.43 | 54.61,11.43 54.61,13.34 56.01,14.61 U1.7 | 54.61,11.43 51.31,11.43 D5.A 50.8,11.43 48.26,8.89 34.61,8.89 33.81,9.68 32.79,10.71 32.79,10.81 C9.1 31.75,11.43 30.48,12.7 30.48,14.61 C8.1
  Bottom 0.152: v9.27,18.54 9.27,13.46 11.68,11.05 v11.7,11.05 v11.71,11.04 | v66.03,44.44 68.55,41.91 v68.58,41.91 | v17.65,15.24 20.32,15.24 22.23,17.14 | v24,13.72 24.83,14.54
  Bottom 0.203: C3.1 66.85,13.5 67.06,13.5 67.87,12.7 R2.1 v80.01,12.7 | C10.1 C11.1 40.6,32.13 v41.91,32.13 42.04,32.13
  Bottom 0.254: J2.7 22.23,17.14 24.83,14.54 26.67,12.7 v29.21,12.7
MISO  (via drill 0.35)
  Top 0.152: ATMEGA328.16 v43.43,28.96
  Bottom 0.152: 52.07,40.64 SV1.1 | 52.07,40.64 43.43,32 v43.43,28.96 | J2.8 8.89,40.64 52.07,40.64
MOSI  (via drill 0.35)
  Top 0.152: ATMEGA328.15 42.93,27.16 42.93,26.73 43.07,26.59 43.81,26.59 44.65,27.43 v44.83,27.43 | v50.8,41.91 54.61,41.91 v54.67,41.84
  Bottom 0.152: SV1.4 58.14,46.71 58.14,45.31 v54.67,41.84 44.83,32 v44.83,27.43 | J2.2 4.1,40.93 5.49,40.93 6.47,41.91 v50.8,41.91
N$1
  Top 0.762: J1.1 88.9,7.62 86.36,5.08 D3.C
  Bottom 0.762: J1.1 88.9,7.62 86.36,5.08 D3.C
N$2
  Top 0.762: J1.3 94.44,10.16 D4.C
  Bottom 0.762: J1.3 94.44,10.16 D4.C
N$3
  Top 0.152: 93.56,22.86 RECT_OK.A 92.29,22.86 R1.2
N$4
  Bottom 0.203: C2.1 R2.2
N$5
  Top 0.203: C7.1 64.83,13.18 U1.1
N$6  (via drill 0.35)
  Top 0.203: C7.2 59.63,13.18 U1.8 | v56.01,15.88 55.89,15.99
  Top 0.762: U1.8 v57.02,13.34 | 55.89,15.99 55.37,16.51 50.8,16.51 D5.C 50.28,16.51 43.18,16.51 42.69,16.02 L1(SRN6045).1
  Bottom 0.762: v57.02,13.34 56.01,14.35 v56.01,15.88
N$7
  Top 0.203: R4.2 58.42,21.59 58.42,19.05 | 58.42,19.05 58.42,17.14 U1.5 | R3.1 58.42,19.05
N$8
  Top 0.152: R5.2 PWR_OK.A
N$9
  Top 0.152: ATMEGA328.20 44.95,31.37 46.1,31.37 46.99,30.48 C12.1
N$10
  Top 0.152: R16.1 25.4,13.97 23.77,12.35 IC1.5
N$11  (via drill 0.35)
  Top 0.152: 21.34,11.7 21.32,11.7 | 21.34,11.7 IC1.4 | IC1.17 16.12,16.89 16.13,16.89 v17.65,16.89 | v20.45,16.89 21.34,16 21.34,11.7
  Bottom 0.152: v17.65,16.89 v20.45,16.89
N$12
  Top 0.152: R9.2 USB_PWR_OK.A
N$13
  Top 0.152: R17.1 29.21,15.24 23.71,9.74 IC1.1
N$15  (via drill 0.35)
  Top 0.152: v13.97,13.97 12.23,12.23 X1.2 | v13.97,16.51 13.97,17.14 14.35,17.53 15.41,17.53 IC1.16
  Bottom 0.152: v13.97,13.97 v13.97,16.51
N$16  (via drill 0.35)
  Top 0.152: X1.3 11.23,11.43 11.45,11.65 12.92,11.65 v13.97,12.7 | v12.7,17.78 13.46,17.78 13.84,18.16 15.39,18.16 IC1.15
  Bottom 0.152: v13.97,12.7 12.7,13.97 v12.7,17.78
N$17
  Top 0.152: R10.2 FTDI_TX.A
N$20
  Top 0.152: R11.2 FTDI_RX.A
PWR_EN
  Top 0.203: U1.3 70.91,15.88 R19.2 R18.1
PWRREG_COMP  (via drill 0.35)
  Top 0.203: U1.6 v57.4,15.88
  Bottom 0.203: v57.4,15.88 57.53,16 C3.2 C2.2
PWRREG_SS
  Top 0.203: C1.2 67.53,17.14 U1.4
RESET
  Top 0.152: ATMEGA328.29 40.53,36.34 40.53,36.77 42.16,38.41 45.72,38.41 | 45.72,38.41 55.88,38.41 62.23,44.76 SV1.5 | 45.72,40.64 R6.1 | 45.72,40.64 45.72,38.41 | C13.2 45.72,40.64
RS485_RX_N
  Top 0.152: 96.48,45.68 RS485_RX.2
  Top 0.203: IC2.7 95.25,44.45 96.48,45.68
RS485_RX_P
  Top 0.152: 96.56,40.68 RS485_RX.1
  Top 0.203: IC2.8 93.98,45.72 95.25,46.99 97.79,46.99 99.06,45.72 99.06,43.18 96.56,40.68
RS485_TX_N
  Top 0.152: IC2.6 85.09,43.18
  Top 0.203: RS485_TX.2 87.59,43.18 85.09,43.18
RS485_TX_P
  Top 0.152: IC2.5 85.09,41.91
  Top 0.203: RS485_TX.1 93.98,31.79 93.98,35.56 87.63,41.91 85.09,41.91
RXD  (via drill 0.35)
  Top 0.152: SV2.3 39.44,44.52 39.44,38.1 | 39.44,38.1 ATMEGA328.30 | R17.2 v29.21,38.1 | v40.64,38.1 39.44,38.1
  Bottom 0.152: v29.21,38.1 v40.64,38.1
SCK  (via drill 0.35)
  Top 0.152: ATMEGA328.17 v46.35,28.96 | v53.34,43.18 v57.4,43.18
  Bottom 0.152: v46.35,28.96 46.35,32.13 v57.4,43.18 59.69,45.47 SV1.3 | J2.1 3.81,43.18 v53.34,43.18
SCL
  Top 0.152: ATMEGA328.28 41.33,36.34 41.33,36.77 42.66,38.1 58.42,38.1 62.09,38.09 68.55,44.56 70.12,46.13 70.12,48.53 71.12,49.53 71.5,49.53 71.98,50.01 72.8,50.01 74.55,48.26 | 74.55,48.26 JP4.2 74.55,48.26
  Bottom 0.152: JP4.2 R8.2
SDA
  Top 0.152: ATMEGA328.27 42.13,36.34 42.13,36.77 43.16,37.8 58.42,37.8 58.75,37.47 62.48,37.47 71.12,46.1 71.12,46.99 JP4.1
  Bottom 0.152: R7.2 JP4.1
SS_RX  (via drill 0.35)
  Top 0.152: ATMEGA328.23 45.23,34.04 45.66,34.04 45.91,34.29 v52.07,34.29 | v72.39,39.37 77.47,44.45 78.74,44.45
  Top 0.203: IC2.2 78.74,44.45 80.01,44.45 82.55,41.91 82.55,35.56 JP1.2
  Bottom 0.152: v52.07,34.29 57.15,39.37 v72.39,39.37
SS_TX  (via drill 0.35)
  Top 0.152: ATMEGA328.24 45.94,35.56 v52.07,35.56 | v74.93,40.64 77.47,43.18 78.74,43.18
  Top 0.203: IC2.3 78.74,43.18 80.01,43.18 81.28,41.91 81.28,34.29 JP1.1
  Bottom 0.152: v52.07,35.56 57.15,40.64 v74.93,40.64
TXD  (via drill 0.35)
  Top 0.152: SV2.2 38.64,46.26 38.64,39.37 | 38.64,39.37 ATMEGA328.31 | R16.2 v25.4,39.37 | v36.83,39.37 38.64,39.37
  Bottom 0.152: v25.4,39.37 v36.83,39.37
USB_VCC
  Top 0.152: IC1.19 IC1.20 15.34,14.86 13.59,14.86 12.7,13.97 C15.2 | C15.2 C14.2 R9.1 R10.1 R11.1 | X1.1 10.07,13.03 C15.2
VCC  (via drill 0.35)
  Top 0.152: R1.1 v87.63,24.13
  Top 0.203: R18.2 v74.93,19.05 | v77.47,16.51 78.95,15.03
  Top 0.762: C16.+ 81.66,17.74 78.95,15.03 C6.2 C5.2 C4.2 68.8,14.61 U1.2
  Bottom 0.152: v87.63,24.13 82.68,19.18 C16.+
  Bottom 0.203: v74.93,19.05 v77.47,16.51
  Bottom 0.406: JP2.1 78.74,10.16 D2.C
  Bottom 0.762: D1.C D2.C 81.77,19.07 C16.+